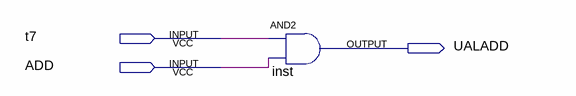
[diagram p0: schematic sheet]
// Quartus schematic UALADD.bdf as structural Verilog: 1 symbols, 3 pins
module UALADD (
  input  t7,
  input  ADD,
  output UALADD
);

  and inst (UALADD, t7, ADD);
endmodule
